# Altium project INV.5KW.OG.PrjPcb (part 1 of 3)
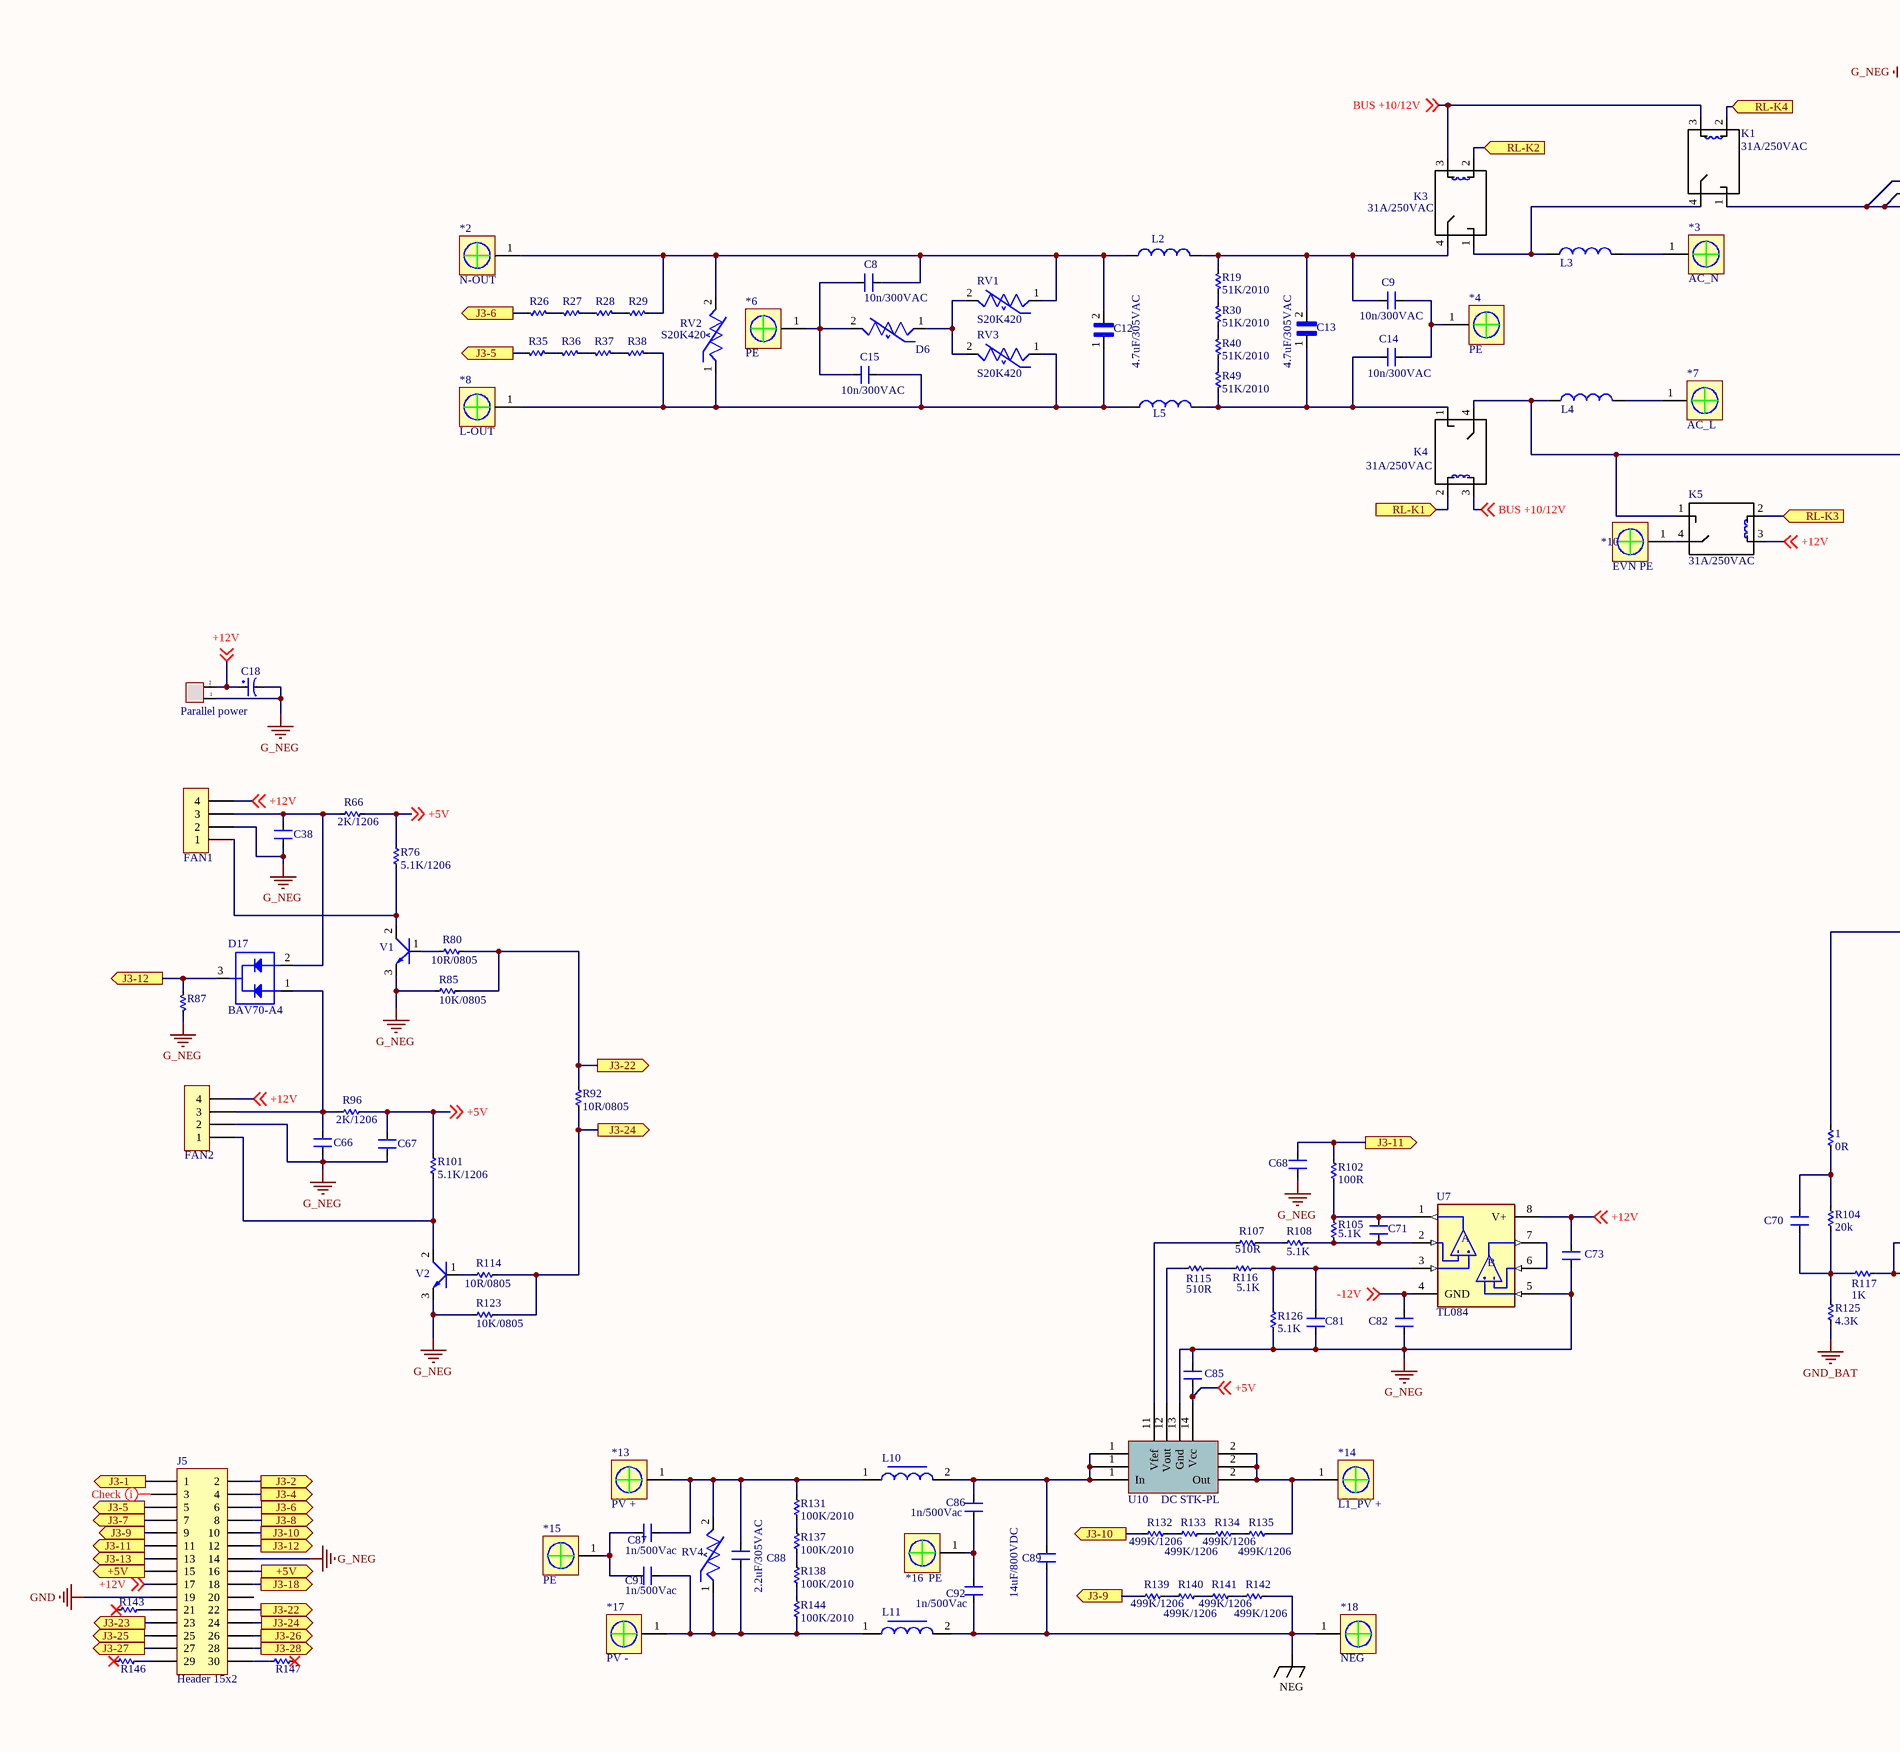
[diagram p0: INV.Power.SchDoc, left]
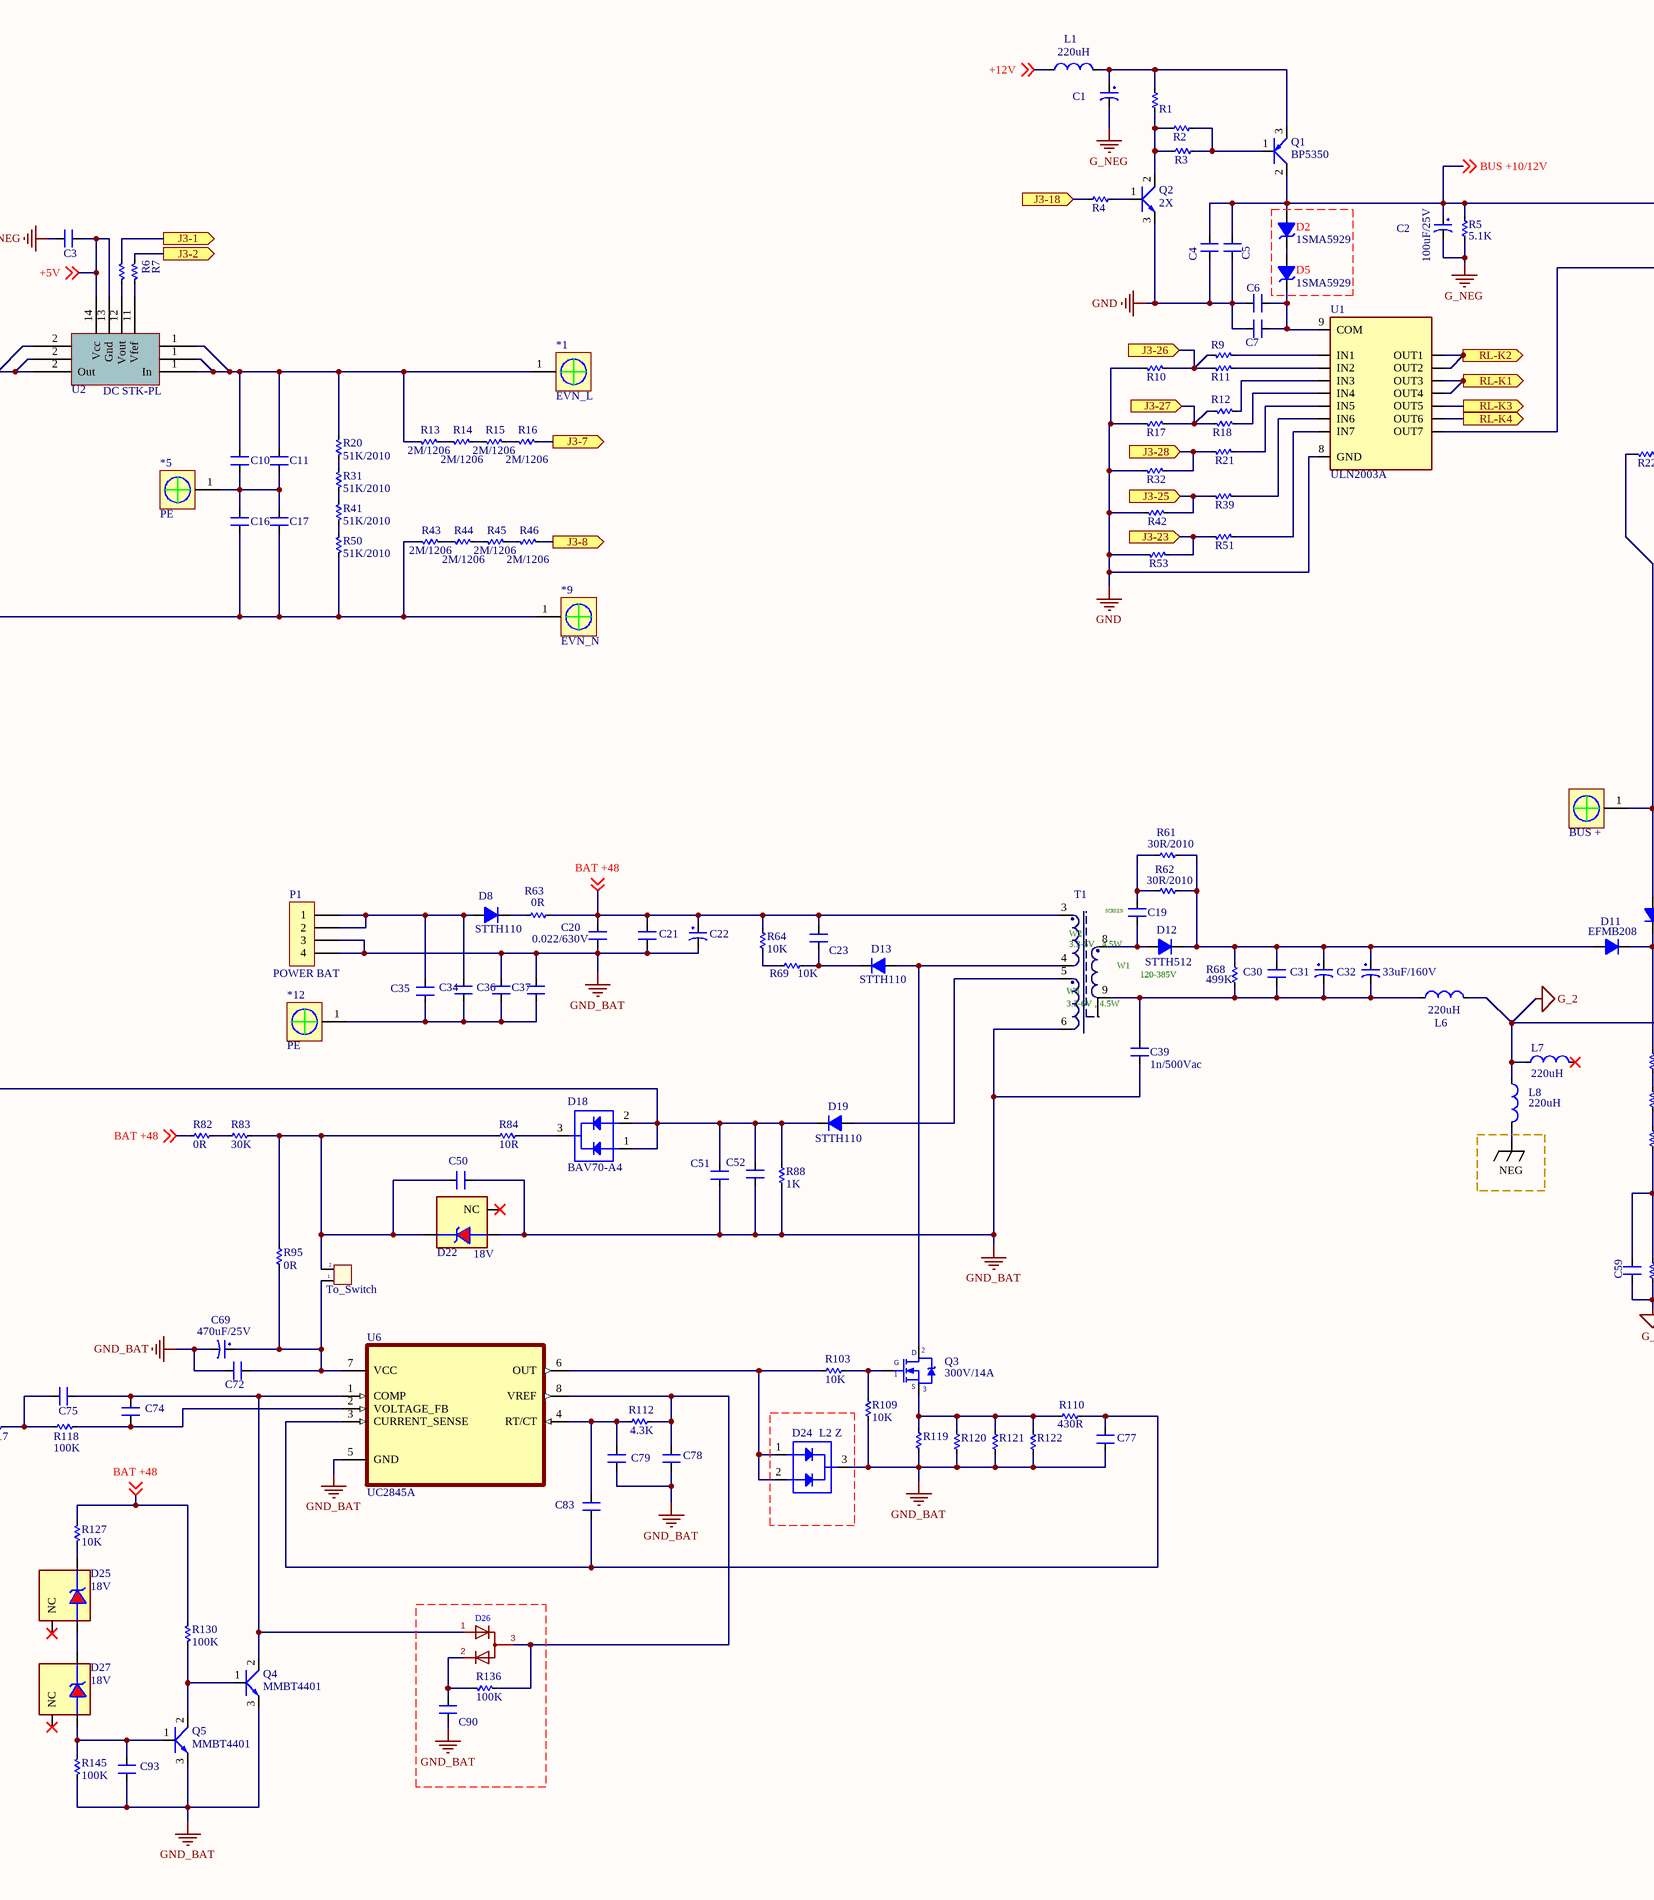
[diagram p1: INV.Power.SchDoc, middle]
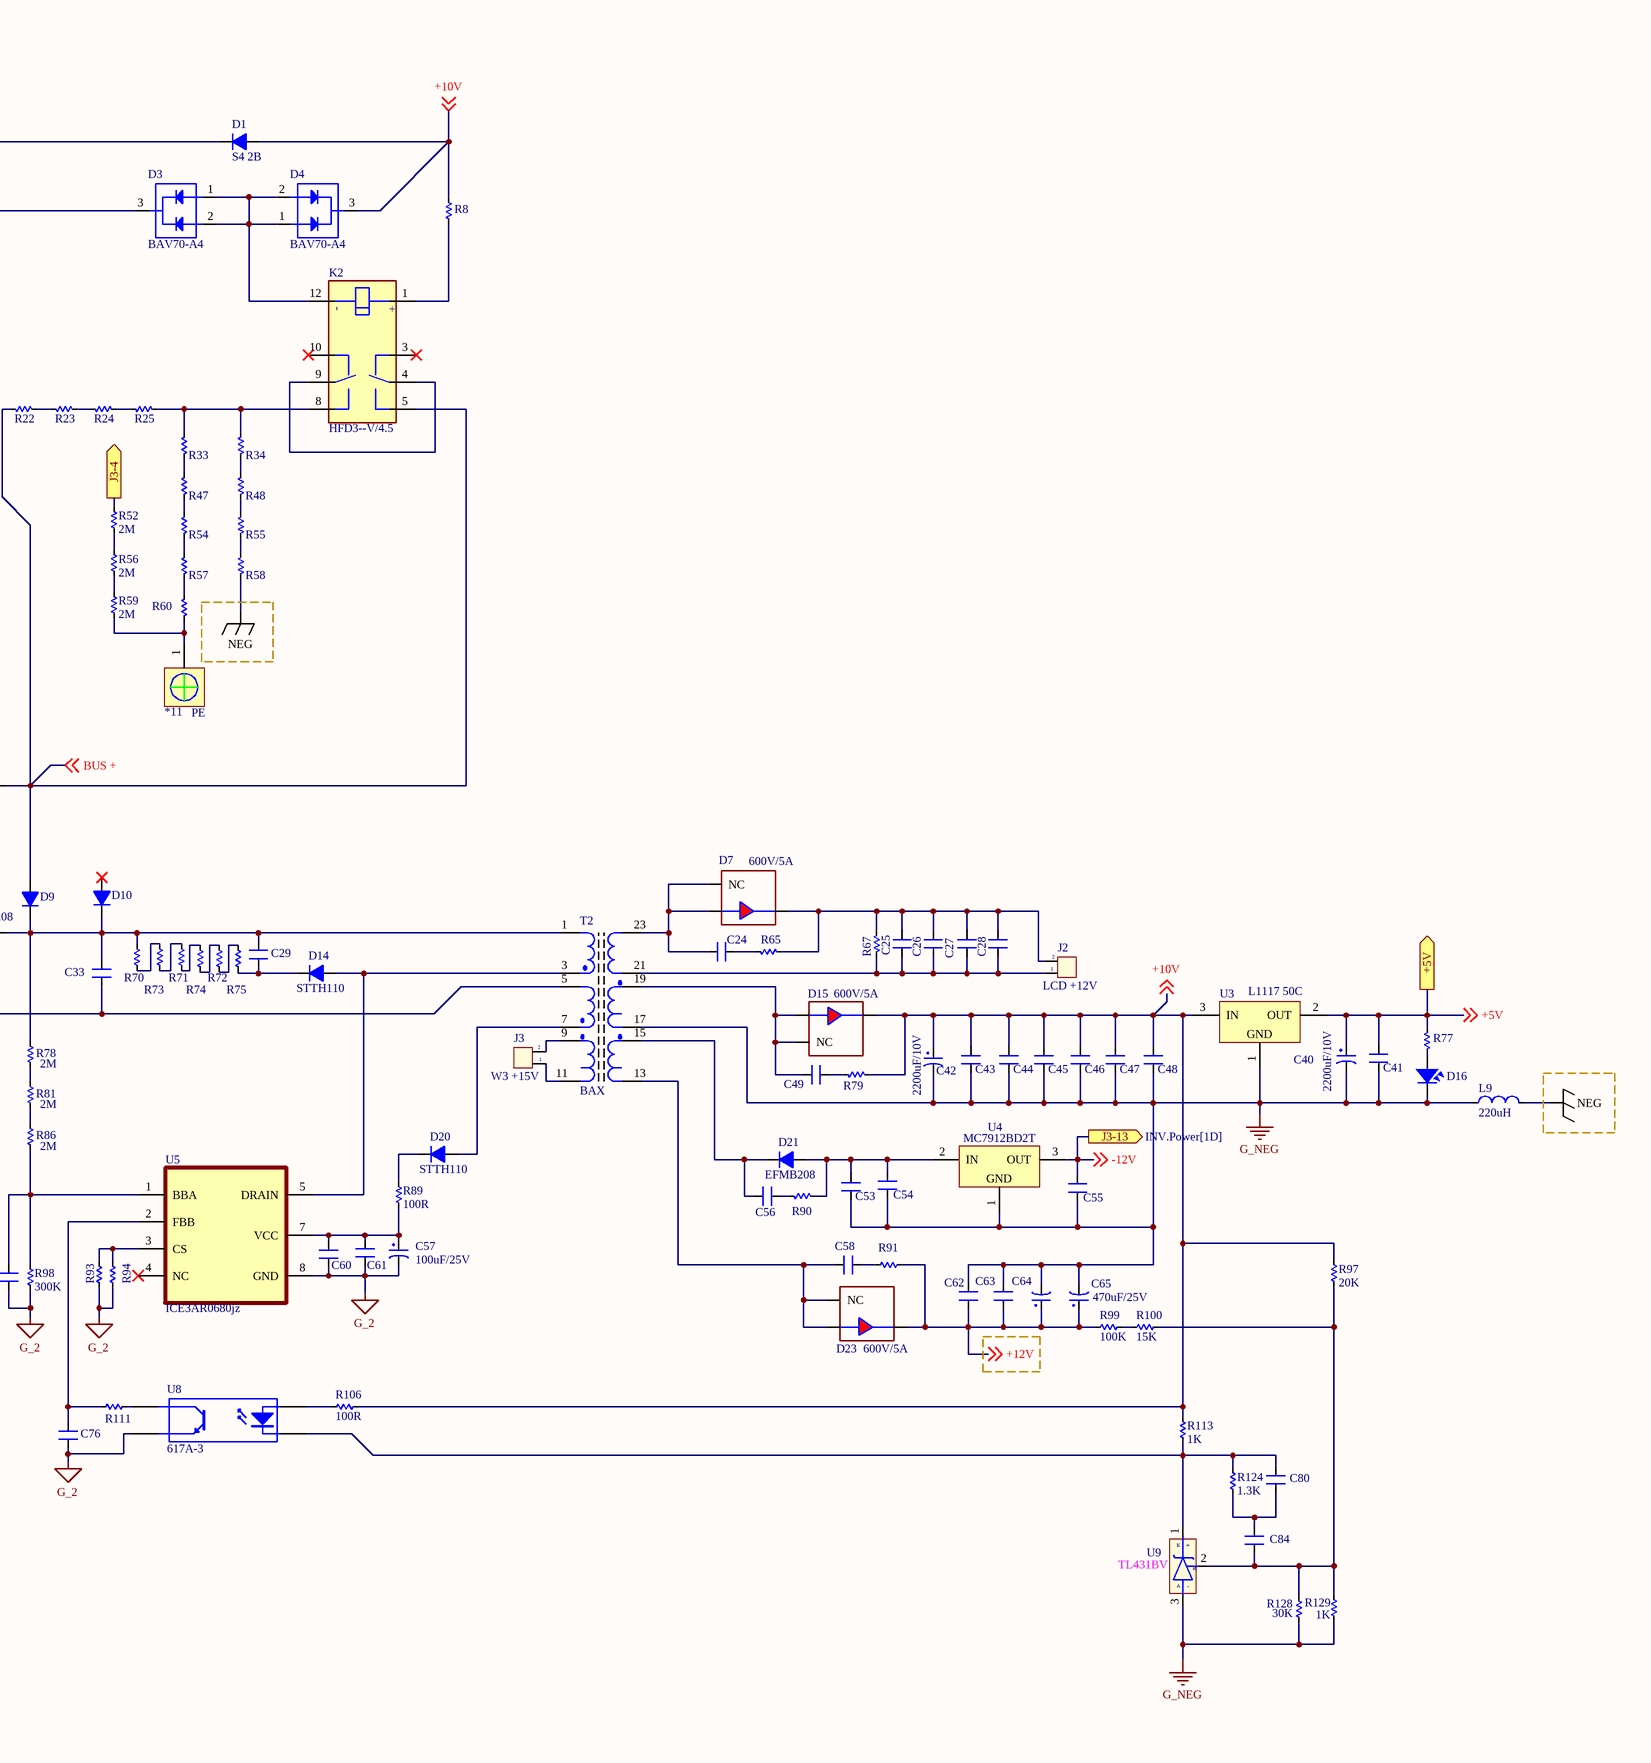
[diagram p2: INV.Power.SchDoc, right]
3 sheets, 965 parts. Net scope: flat (ports and power ports of the same name join across sheets).
Sheets:
  INV.Power.SchDoc
  INV.Main.SchDoc
  INV.ControlMCU.SchDoc

## Sheet INV.Power.SchDoc
size 1050 x 400 mm; SheetNumber: 1; SheetTotal: 3

### Parts
1  0R  [RES-SMD-0603 EX]
*1  EVN_L  [Copper Pipe]
*2  N-OUT  [Copper Pipe]
*3  AC_N  [Copper Pipe]
*4  PE  [Copper Pipe]
*5  PE  [Copper Pipe]
*6  PE  [Copper Pipe]
*7  AC_L  [Copper Pipe]
*8  L-OUT  [Copper Pipe]
*9  EVN_N  [Copper Pipe]
*10  EVN PE  [Copper Pipe]
*11  PE  [Copper Pipe]
*12  PE  [Copper Pipe]
*13  PV +  [Copper Pipe]
*14  L1_PV +  [Copper Pipe]
*15  PE  [Copper Pipe]
*16  PE  [Copper Pipe]
*17  PV -  [Copper Pipe]
*18  NEG  [Copper Pipe]
C1  100uF/25V  [CAP-10X17-N]  (value not drawn)
C2  100uF/25V  [CAP-10X17-N]
C3  10n/300VAC  [CAP-SMD-0805 EX]  (value not drawn)
C4  (no value)  [CAP-SMD-0805 EX]
C5  (no value)  [CAP-SMD-0805 EX]
C6  (no value)  [CAP-SMD-0805 EX]
C7  (no value)  [CAP-SMD-0805 EX]
C8  10n/300VAC  [CAP-SMD-0805 EX]
C9  10n/300VAC  [CAP-SMD-0805 EX]
C10  10n/300VAC  [CAP-SMD-0805 EX]  (value not drawn)
C11  10n/300VAC  [CAP-SMD-0805 EX]  (value not drawn)
C12  4.7uF/305VAC  [CAPRR2250W80L2600T850H1500]
C13  4.7uF/305VAC  [CAPRR2250W80L2600T850H1500]
C14  10n/300VAC  [CAP-SMD-0805 EX]
C15  10n/300VAC  [CAP-SMD-0805 EX]
C16  10n/300VAC  [CAP-SMD-0805 EX]  (value not drawn)
C17  10n/300VAC  [CAP-SMD-0805 EX]  (value not drawn)
C18  470uF/25V  [CAP-10X17-N]  (value not drawn)
C19  (no value)  [CAP-SMD-0805 EX]
C20  0.022/630V  [CAP-SMD-0805 EX]
C21  (no value)  [CAP-SMD-0805 EX]
C22  27uF/100V  [CAP-10X17-N]  (value not drawn)
C23  (no value)  [CAP-SMD-0805 EX]
C24  (no value)  [CAP-SMD-0805 EX]
C25  223J630V  [CAP-SMD-0805 EX]  (value not drawn)
C26  223J630V  [CAP-SMD-0805 EX]  (value not drawn)
C27  223J630V  [CAP-SMD-0805 EX]  (value not drawn)
C28  223J630V  [CAP-SMD-0805 EX]  (value not drawn)
C29  223J630V  [CAP-SMD-0805 EX]  (value not drawn)
C30  (no value)  [CAP-SMD-0805 EX]
C31  33uF/160V  [CAP-10X17-N]  (value not drawn)
C32  33uF/160V  [CAP-10X17-N]
C33  2uF/600VDC  [CAP-SMD-0805 EX]  (value not drawn)
C34  (no value)  [CAP-SMD-0805 EX]
C35  (no value)  [CAP-SMD-0805 EX]
C36  (no value)  [CAP-SMD-0805 EX]
C37  (no value)  [CAP-SMD-0805 EX]
C38  (no value)  [CAP-SMD-0805 EX]
C39  1n/500Vac  [CAP-SMD-0805 EX]
C40  2200uF/10V  [CAP-10X17-N]
C41  (no value)  [CAP-SMD-0805 EX]
C42  2200uF/10V  [CAP-10X17-N]
C43  (no value)  [CAP-SMD-0805 EX]
C44  (no value)  [CAP-SMD-0805 EX]
C45  (no value)  [CAP-SMD-0805 EX]
C46  (no value)  [CAP-SMD-0805 EX]
C47  (no value)  [CAP-SMD-0805 EX]
C48  (no value)  [CAP-SMD-0805 EX]
C49  (no value)  [CAP-SMD-0805 EX]
C50  (no value)  [CAP-SMD-0805 EX]
C51  (no value)  [CAP-SMD-0805 EX]
C52  (no value)  [CAP-SMD-0805 EX]
C53  (no value)  [CAP-SMD-0805 EX]
C54  (no value)  [CAP-SMD-0805 EX]
C55  (no value)  [CAP-SMD-0805 EX]
C56  (no value)  [CAP-SMD-0805 EX]
C57  100uF/25V  [CAP-10X17-N]
C58  (no value)  [CAP-SMD-0805 EX]
C59  (no value)  [CAP-SMD-0805 EX]
C60  223J630V  [CAP-SMD-0805 EX]  (value not drawn)
C61  223J630V  [CAP-SMD-0805 EX]  (value not drawn)
C62  (no value)  [CAP-SMD-0805 EX]
C63  (no value)  [CAP-SMD-0805 EX]
C64  470uF/25V  [CAP-10X17-N]  (value not drawn)
C65  470uF/25V  [CAP-10X17-N]
C66  (no value)  [CAP-SMD-0805 EX]
C67  (no value)  [CAP-SMD-0805 EX]
C68  (no value)  [CAP-SMD-0805 EX]
C69  470uF/25V  [CAP-10X17-N]
C70  (no value)  [CAP-SMD-0805 EX]
C71  (no value)  [CAP-SMD-0805 EX]
C72  (no value)  [CAP-SMD-0805 EX]
C73  (no value)  [CAP-SMD-0805 EX]
C74  (no value)  [CAP-SMD-0805 EX]
C75  (no value)  [CAP-SMD-0805 EX]
C76  (no value)  [CAP-SMD-0805 EX]
C77  (no value)  [CAP-SMD-0805 EX]
C78  (no value)  [CAP-SMD-0805 EX]
C79  (no value)  [CAP-SMD-0805 EX]
C80  (no value)  [CAP-SMD-0805 EX]
C81  (no value)  [CAP-SMD-0805 EX]
C82  (no value)  [CAP-SMD-0805 EX]
C83  (no value)  [CAP-SMD-0805 EX]
C84  (no value)  [CAP-SMD-0805 EX]
C85  (no value)  [CAP-SMD-0805 EX]
C86  1n/500Vac  [CAP-SMD-0805 EX]
C87  1n/500Vac  [CAP-SMD-0805 EX]
C88  2.2uF/305VAC  [CAP-SMD-0805 EX]
C89  14uF/800VDC  [CAP-SMD-0805 EX]
C90  (no value)  [CAP-SMD-0805 EX]
C91  1n/500Vac  [CAP-SMD-0805 EX]
C92  1n/500Vac  [CAP-SMD-0805 EX]
C93  (no value)  [CAP-SMD-0805 EX]
D1  S4 2B  [1N4148]
D2  1SMA5929  [DIODE ZENNER SOD123 *]
D3  BAV70-A4  [DIO_STTH2003CG-TR]
D4  BAV70-A4  [DIO_STTH2003CG-TR]
D5  1SMA5929  [DIODE ZENNER SOD123 *]
D6  EPCOS  [VAR_B72220S0301K101]  (value not drawn)
D7  600V/5A  [SOT95P237X112-3N]
D8  STTH110  [1N4148]
D9  EFMB208  [1N4148]  (value not drawn)
D10  EFMB208  [1N4148]  (value not drawn)
D11  EFMB208  [1N4148]
D12  STTH512  [1N4148]
D13  STTH110  [1N4148]
D14  STTH110  [1N4148]
D15  600V/5A  [SOT95P237X112-3N]
D16  LED  [LED 2835 NEW]  (value not drawn)
D17  BAV70-A4  [DIO_STTH2003CG-TR]
D18  BAV70-A4  [DIO_STTH2003CG-TR]
D19  STTH110  [1N4148]
D20  STTH110  [1N4148]
D21  EFMB208  [1N4148]
D22  18V  [SOT95P237X112-3N]
D23  600V/5A  [SOT95P237X112-3N]
D24  L2 Z  [DIO_STTH2003CG-TR]
D25  18V  [SOT95P237X112-3N]
D26  Dual-Diode_CA_1  [SOT-23]  (value not drawn)
D27  18V  [SOT95P237X112-3N]
H1  FAN1  [XH2.54M-4]
H2  FAN2  [XH2.54M-4]
J1  Parallel power  [Jump2]
J2  LCD +12V  [Jump2]
J3  W3 +15V  [Jump2]
J4  To_Switch  [Jump2]
J5  Header 15x2  [Head 1X16 - CAI THANG]
K1  31A/250VAC  [RELAY 10A/250V]
K2  HFD3--V/4.5  [HFD3]
K3  31A/250VAC  [RELAY 10A/250V]
K4  31A/250VAC  [RELAY 10A/250V]
K5  31A/250VAC  [RELAY 10A/250V]
L1  220uH  [CUON LOC 1010]
L2  Cuộn L  [IND_1210]  (value not drawn)
L3  Cuộn L  [IND_1210]  (value not drawn)
L4  Cuộn L  [IND_1210]  (value not drawn)
L5  Cuộn L  [IND_1210]  (value not drawn)
L6  220uH  [CUON LOC 1010]
L7  220uH  [CUON LOC 1010]
L8  220uH  [CUON LOC 1010]
L9  220uH  [CUON LOC 1010]
L10  L  [Cuan Cam PWM Hybrid]  (value not drawn)
L11  L  [Cuan Cam PWM Hybrid]  (value not drawn)
P1  POWER BAT  [XH2.54M-4]
PV_+1  BUS +  [Copper Pipe]
Q1  BP5350  [QTO-92]
Q2  2X
Q3  300V/14A  [TO220H1]
Q4  MMBT4401
Q5  MMBT4401
R1  10K  [RES-SMD-0603 EX]  (value not drawn)
R2  2K  [RES-SMD-0603 EX]  (value not drawn)
R3  2K  [RES-SMD-0603 EX]  (value not drawn)
R4  20K  [RES-SMD-0603 EX]  (value not drawn)
R5  5.1K  [RES-SMD-0603 EX]
R6  1K/0603  [RES-SMD-0603 EX]  (value not drawn)
R7  1K/0603  [RES-SMD-0603 EX]  (value not drawn)
R8  51R  [RES-SMD-0603 EX]  (value not drawn)
R9  10R  [RES-SMD-0603 EX]  (value not drawn)
R10  5.1K  [RES-SMD-0603 EX]  (value not drawn)
R11  10R  [RES-SMD-0603 EX]  (value not drawn)
R12  10R  [RES-SMD-0603 EX]  (value not drawn)
R13  2M/1206  [RES-SMD-0603 EX]
R14  2M/1206  [RES-SMD-0603 EX]
R15  2M/1206  [RES-SMD-0603 EX]
R16  2M/1206  [RES-SMD-0603 EX]
R17  5.1K  [RES-SMD-0603 EX]  (value not drawn)
R18  10R  [RES-SMD-0603 EX]  (value not drawn)
R19  51K/2010  [RES-SMD-0603 EX]
R20  51K/2010  [RES-SMD-0603 EX]
R21  10R  [RES-SMD-0603 EX]  (value not drawn)
R22  499K  [RES-SMD-0603 EX]  (value not drawn)
R23  499K  [RES-SMD-0603 EX]  (value not drawn)
R24  499K  [RES-SMD-0603 EX]  (value not drawn)
R25  499K  [RES-SMD-0603 EX]  (value not drawn)
R26  2M/1206  [RES-SMD-0603 EX]  (value not drawn)
R27  2M/1206  [RES-SMD-0603 EX]  (value not drawn)
R28  2M/1206  [RES-SMD-0603 EX]  (value not drawn)
R29  2M/1206  [RES-SMD-0603 EX]  (value not drawn)
R30  51K/2010  [RES-SMD-0603 EX]
R31  51K/2010  [RES-SMD-0603 EX]
R32  5.1K  [RES-SMD-0603 EX]  (value not drawn)
R33  200K  [RES-SMD-0603 EX]  (value not drawn)
R34  499K  [RES-SMD-0603 EX]  (value not drawn)
R35  2M/1206  [RES-SMD-0603 EX]  (value not drawn)
R36  2M/1206  [RES-SMD-0603 EX]  (value not drawn)
R37  2M/1206  [RES-SMD-0603 EX]  (value not drawn)
R38  2M/1206  [RES-SMD-0603 EX]  (value not drawn)
R39  10R  [RES-SMD-0603 EX]  (value not drawn)
R40  51K/2010  [RES-SMD-0603 EX]
R41  51K/2010  [RES-SMD-0603 EX]
R42  5.1K  [RES-SMD-0603 EX]  (value not drawn)
R43  2M/1206  [RES-SMD-0603 EX]
R44  2M/1206  [RES-SMD-0603 EX]
R45  2M/1206  [RES-SMD-0603 EX]
R46  2M/1206  [RES-SMD-0603 EX]
R47  200K  [RES-SMD-0603 EX]  (value not drawn)
R48  499K  [RES-SMD-0603 EX]  (value not drawn)
R49  51K/2010  [RES-SMD-0603 EX]
R50  51K/2010  [RES-SMD-0603 EX]
R51  10R  [RES-SMD-0603 EX]  (value not drawn)
R52  2M  [RES-SMD-0603 EX]
R53  5.1K  [RES-SMD-0603 EX]  (value not drawn)
R54  200K  [RES-SMD-0603 EX]  (value not drawn)
R55  499K  [RES-SMD-0603 EX]  (value not drawn)
R56  2M  [RES-SMD-0603 EX]
R57  200K  [RES-SMD-0603 EX]  (value not drawn)
R58  499K  [RES-SMD-0603 EX]  (value not drawn)
R59  2M  [RES-SMD-0603 EX]
R60  200K  [RES-SMD-0603 EX]  (value not drawn)
R61  30R/2010  [RES-SMD-0603 EX]
R62  30R/2010  [RES-SMD-0603 EX]
R63  0R  [RES-SMD-0603 EX]
R64  10K  [RES-SMD-0603 EX]
R65  10K/2010  [RES-SMD-0603 EX]  (value not drawn)
R66  2K/1206  [RES-SMD-0603 EX]
R67  10K/2010  [RES-SMD-0603 EX]  (value not drawn)
R68  499K  [RES-SMD-0603 EX]
R69  10K  [RES-SMD-0603 EX]
R70  10K/2010  [RES-SMD-0603 EX]  (value not drawn)
R71  10K/2010  [RES-SMD-0603 EX]  (value not drawn)
R72  10K/2010  [RES-SMD-0603 EX]  (value not drawn)
R73  10K/2010  [RES-SMD-0603 EX]  (value not drawn)
R74  10K/2010  [RES-SMD-0603 EX]  (value not drawn)
R75  10K/2010  [RES-SMD-0603 EX]  (value not drawn)
R76  5.1K/1206  [RES-SMD-0603 EX]
R77  5.1K  [RES-SMD-0603 EX]  (value not drawn)
R78  2M  [RES-SMD-0603 EX]
R79  10K/2010  [RES-SMD-0603 EX]  (value not drawn)
R80  10R/0805  [RES-SMD-0603 EX]
R81  2M  [RES-SMD-0603 EX]
R82  0R  [RES-SMD-0603 EX]
R83  30K  [RES-SMD-0603 EX]
R84  10R  [RES-SMD-0603 EX]
R85  10K/0805  [RES-SMD-0603 EX]
R86  2M  [RES-SMD-0603 EX]
R87  5.1K/1206  [RES-SMD-0603 EX]  (value not drawn)
R88  1K  [RES-SMD-0603 EX]
R89  100R  [RES-SMD-0603 EX]
R90  150R/1206  [RES-SMD-0603 EX]  (value not drawn)
R91  150R/1206  [RES-SMD-0603 EX]  (value not drawn)
R92  10R/0805  [RES-SMD-0603 EX]
R93  0.33R/2010  [RES-SMD-0603 EX]  (value not drawn)
R94  0.33R/2010  [RES-SMD-0603 EX]  (value not drawn)
R95  0R  [RES-SMD-0603 EX]
R96  2K/1206  [RES-SMD-0603 EX]
R97  20K  [RES-SMD-0603 EX]
R98  300K  [RES-SMD-0603 EX]
R99  100K  [RES-SMD-0603 EX]
R100  15K  [RES-SMD-0603 EX]
R101  5.1K/1206  [RES-SMD-0603 EX]
R102  100R  [RES-SMD-0603 EX]
R103  10K  [RES-SMD-0603 EX]
R104  20k  [RES-SMD-0603 EX]
R105  5.1K  [RES-SMD-0603 EX]
R106  100R  [RES-SMD-0603 EX]
R107  510R  [RES-SMD-0603 EX]
R108  5.1K  [RES-SMD-0603 EX]
R109  10K  [RES-SMD-0603 EX]
R110  430R  [RES-SMD-0603 EX]
R111  22R  [RES-SMD-0603 EX]  (value not drawn)
R112  4.3K  [RES-SMD-0603 EX]
R113  1K  [RES-SMD-0603 EX]
R114  10R/0805  [RES-SMD-0603 EX]
R115  510R  [RES-SMD-0603 EX]
R116  5.1K  [RES-SMD-0603 EX]
R117  1K  [RES-SMD-0603 EX]
R118  100K  [RES-SMD-0603 EX]
R119  0.33R/2010  [RES-SMD-0603 EX]  (value not drawn)
R120  0.33R/2010  [RES-SMD-0603 EX]  (value not drawn)
R121  0.33R/2010  [RES-SMD-0603 EX]  (value not drawn)
R122  0.33R/2010  [RES-SMD-0603 EX]  (value not drawn)
R123  10K/0805  [RES-SMD-0603 EX]
R124  1.3K  [RES-SMD-0603 EX]
R125  4.3K  [RES-SMD-0603 EX]
R126  5.1K  [RES-SMD-0603 EX]
R127  10K  [RES-SMD-0603 EX]
R128  30K  [RES-SMD-0603 EX]
R129  1K  [RES-SMD-0603 EX]
R130  100K  [RES-SMD-0603 EX]
R131  100K/2010  [RES-SMD-0603 EX]
R132  499K/1206  [RES-SMD-0603 EX]
R133  499K/1206  [RES-SMD-0603 EX]
R134  499K/1206  [RES-SMD-0603 EX]
R135  499K/1206  [RES-SMD-0603 EX]
R136  100K  [RES-SMD-0603 EX]
R137  100K/2010  [RES-SMD-0603 EX]
R138  100K/2010  [RES-SMD-0603 EX]
R139  499K/1206  [RES-SMD-0603 EX]
R140  499K/1206  [RES-SMD-0603 EX]
R141  499K/1206  [RES-SMD-0603 EX]
R142  499K/1206  [RES-SMD-0603 EX]
R143  (no value)  [RES-SMD-0603 EX]
R144  100K/2010  [RES-SMD-0603 EX]
R145  100K  [RES-SMD-0603 EX]
R146  (no value)  [RES-SMD-0603 EX]
R147  (no value)  [RES-SMD-0603 EX]
RV1  S20K420  [VAR_B72220S0301K101]
RV2  S20K420  [VAR_B72220S0301K101]
RV3  S20K420  [VAR_B72220S0301K101]
RV4  S20K420  [VAR_B72220S0301K101]  (value not drawn)
T1  (no value)  [EE16/7/4 (E16)]
T2  BAX  [BAX_DVD3]
U1  ULN2003A  [TSSOP-16-TI]
U2  DC STK-PL  [Bien ap do Current]
U3  L1117 50C  [SOT89N (3D)]
U4  MC7912BD2T  [HDR1x3 BIG]
U5  ICE3AR0680jz  [SOIC127P600X175-8N]
U6  UC2845A  [SOIC127P600X175-8N]
U7  TL084  [DIP794W45P254L959H508Q8]
U8  617A-3  [OPTO TRANSISTOR_SOP-4]
U9  TL431BV  [TL431]
U10  DC STK-PL  [Bien ap do Current]
V1  (no value)
V2  (no value)

### Ports
+5V (out, see INV.ControlMCU[1D], INV.Main[1D], INV.Main[3A], INV.Main[3D], INV.Main[4A], INV.Power[1D]), +5V (out, see INV.ControlMCU[1D], INV.Main[1D], INV.Main[3A], INV.Main[3D], INV.Main[4A], INV.Power[1D], INV.Power[6C]), J3-1 (out, see INV.Power[1D]), J3-1 (out, see INV.Power[3A]), J3-2 (out, see INV.Power[1D]), J3-2 (out, see INV.Power[3A]), J3-4 (out, see INV.Power[1D]), J3-4 (out, see INV.Power[5B]), J3-5 (out, see INV.Power[1B]), J3-5 (out, see INV.Power[1D]), J3-6 (out, see INV.Power[1A]), J3-6 (out, see INV.Power[1D]), J3-7 (out, see INV.Power[1D]), J3-7 (out, see INV.Power[3A]), J3-8 (out, see INV.Power[1D]), J3-8 (out, see INV.Power[3B]), J3-9 (out, see INV.Power[1D]), J3-9 (out, see INV.Power[2D]), J3-10 (out, see INV.Power[1D]), J3-10 (out, see INV.Power[2D]), J3-11 (out, see INV.Power[1D]), J3-11 (out, see INV.Power[2C]), J3-12 (out, see INV.Power[1C]), J3-12 (out, see INV.Power[1D]), J3-13 (out, see INV.Power[1D]), J3-13 (out, see INV.Power[6C]), J3-18 (in, see INV.Power[1D]), J3-18 (out, see INV.Power[4A]), J3-22 (out, see INV.Power[1C]), J3-22 (out, see INV.Power[1D]), J3-23 (in, see INV.Power[1D]), J3-23 (out, see INV.Power[4B]), J3-24 (out, see INV.Power[1C]), J3-24 (out, see INV.Power[1D]), J3-25 (in, see INV.Power[1D]), J3-25 (out, see INV.Power[4B]), J3-26 (in, see INV.Power[1D]), J3-26 (out, see INV.Power[4A]), J3-27 (in, see INV.Power[1D]), J3-27 (out, see INV.Power[4A]), J3-28 (in, see INV.Power[1D]), J3-28 (out, see INV.Power[4A]), RL-K1 (in, see INV.Power[4A]), RL-K1 (out, see INV.Power[2B]), RL-K2 (in, see INV.Power[4A]), RL-K2 (out, see INV.Power[2A]), RL-K3 (in, see INV.Power[4A]), RL-K3 (out, see INV.Power[3B]), RL-K4 (in, see INV.Power[4A]), RL-K4 (out, see INV.Power[3A])

### Nets
G_2: C33.1 C57.2 C59.1 C60.2 C61.2 C76.1 L6.2 L7.2 L8.2 R93.2 R94.2 R98.1 T2.5 U5.8(GND) U8.3
G_NEG: C1.2 C2.2 C3.1 C18.2 C38.1 C40.2 C41.2 C42.2 C43.2 C44.2 C45.2 C46.2 C47.2 C48.2 C53.1 C54.1 C55.1 C62.1 C63.1 C64.2 C65.2 C66.1 C67.1 C68.2 C73.2 C81.2 C82.2 C85.2 D16.2 H1.2 H2.2 J1.1 J5.14 L9.1 R5.1 R85.2 R87.1 R123.2 R126.2 R128.1 R129.1 T2.17 U3.1(GND) U4.1(GND) U7.5(+INB) U9.3(-) U10.13(Gnd) V1.3(E) V2.3(E)
GND: C4.1 C5.1 C6.1 C7.1 J5.19 Q2.3(E) R10.2 R17.2 R32.2 R42.2 R53.2 U1.8(GND)
GND_BAT: C20.1 C21.1 C22.2 C36.2 C37.2 C39.2 C50.1 C51.1 C52.1 C69.2 C72.1 C77.1 C78.1 C79.1 C90.1 C93.2 D22.1(A) D24.3(K) P1.3 P1.4 Q4.3(E) Q5.3(E) R88.2 R109.2 R119.2 R120.2 R121.2 R122.2 R125.2 R145.2 T1.6 U6.5(GND)
NEG: *18.1 C89.1 C92.2 L8.1 L9.2 L11.2 R58.2 R142.1
+5V: C3.2 C40.1 C41.1 C67.2 C85.1 J5.15 J5.16 R66.2 R76.2 R77.2 R96.2 R101.2 U2.13(Gnd) U2.14(Vcc) U3.2(OUT) U10.14(Vcc) ; off-sheet +5V, port +5V
+10V: C42.1 C43.1 C44.1 C45.1 C46.1 C47.1 C48.1 D1.1(A) D4.3(K) D15.3(K) R8.1 R79.1 R97.1 R106.1 R113.1 U3.3(IN) ; off-sheet +10V
+12V: C18.1 C62.2 C63.2 C64.1 C65.1 C73.1 D23.3(K) H1.4 H2.4 J1.2 J5.17 K5.3 L1.1 R91.1 R99.2 U7.8(V+) ; off-sheet +12V
-12V: C55.2 C82.1 J5.13 U4.3(OUT) U7.4(GND) ; off-sheet -12V, port J3-13
BAT +48: C20.2 C21.2 C22.1 C23.1 R63.2 R64.1 R82.1 R127.2 R130.1 T1.3 ; off-sheet BAT +48
BUS +: D9.1(A) K2.5 PV_+1.1 R22.1 ; off-sheet BUS +
BUS +10/12V: C2.1 C4.2 C5.2 D1.2(K) D2.2(A) K1.3 K3.3 K4.3 Q1.2(C) R5.2 ; off-sheet BUS +10/12V
Net1_1: 1.1 C51.2 C52.2 D18.1(A1) D18.2(A2) D19.2(K) R88.1
Net1_2: 1.2 C70.2 R104.1
Net*1_1: *1.1 C10.1 C11.1 R13.1 R20.1 U2.1(In)
Net*2_1: *2.1 C8.1 C12.2 L2.2 R29.1 RV1.1 RV2.2
Net*3_1: *3.1 L3.1
Net*4_1: *4.1 C9.2 C14.1
Net*5_1: *5.1 C10.2 C11.2 C16.1 C17.1
Net*6_1: *6.1 C8.2 C15.2 D6.2
Net*7_1: *7.1 L4.1
Net*8_1: *8.1 C12.1 C15.1 L5.2 R38.1 RV2.1 RV3.1
Net*9_1: *9.1 C16.2 C17.2 K4.4 K5.1 L4.2 R43.1 R50.2
Net*10_1: *10.1 K5.4
Net*11_1: *11.1 R59.1 R60.2
Net*12_1: *12.1 C34.1 C35.1 C36.1 C37.1
Net*13_1: *13.1 C87.2 C88.2 L10.1 R131.1 RV4.2
Net*14_1: *14.1 R135.1 U10.2(Out)
Net*15_1: *15.1 C87.1 C91.1
Net*16_1: *16.1 C86.1 C92.1
Net*17_1: *17.1 C88.1 C91.2 L11.1 R144.1 RV4.1
NetC1_1: C1.1 L1.2 Q1.3(E) R1.2
NetC6_2: C6.2 C7.2 D5.1(K) U1.9(COM)
NetC9_1: C9.1 C13.2 K3.4 L2.1 R19.1
NetC13_1: C13.1 C14.2 K4.1 L5.1 R49.2
NetC19_1: C19.1 D12.1(A) T1.8
NetC19_2: C19.2 R61.1 R62.1
NetC23_2: C23.2 D13.2(K) R69.1
NetC24_1: C24.1 D7.1(A) D7.2(NC) T2.23
NetC24_2: C24.2 R65.1
NetC25_1: C25.1 C26.1 C27.1 C28.1 D7.3(K) J2.2 R65.2 R67.1
NetC25_2: C25.2 C26.2 C27.2 C28.2 J2.1 R67.2 T2.21
NetC29_1: C29.1 D14.2(K) R75.1
NetC29_2: C29.2 C33.2 D9.2(K) D10.2(K) D11.2(K) R70.2 R78.2 T2.1
NetC30_1: C30.1 C31.1 C32.1 D11.1(A) D12.2(K) R61.2 R62.2 R68.1
NetC30_2: C30.2 C31.2 C32.2 C39.1 L6.1 R68.2 T1.9
NetC34_2: C34.2 C35.2 D8.1(A) P1.1 P1.2
NetC38_2: C38.2 D17.2(A2) H1.3 R66.1
NetC49_1: C49.1 R79.2
NetC49_2: C49.2 D15.1(A) D15.2(NC) T2.19
NetC50_2: C50.2 D22.3(K) J4.2 R83.2 R84.1 R95.1
NetC53_2: C53.2 C54.2 D21.1(A) R90.1 U4.2(IN)
NetC56_1: C56.1 R90.2
NetC56_2: C56.2 D21.2(K) T2.15
NetC57_1: C57.1 C60.1 C61.1 R89.2 U5.7(VCC)
NetC58_1: C58.1 R91.2
NetC58_2: C58.2 D23.1(A) D23.2(NC) T2.13
NetC59_2: C59.2 R86.1 R98.2 U5.1(BBA)
NetC66_2: C66.2 D17.1(A1) H2.3 R96.1
NetC68_1: C68.1 J5.11 R102.2 ; port J3-11
NetC69_1: C69.1 C72.2 J4.1 R95.2 U6.7(VCC)
NetC70_1: C70.1 R104.2 R117.2 R125.1
NetC71_1: C71.1 R105.1 R108.1 U7.2(-INA)
NetC71_2: C71.2 R102.1 R105.2 U7.1(OUTA)
NetC74_1: C74.1 C75.2 D26.1(C) Q4.2(C) U6.1(COMP)
NetC74_2: C74.2 R118.1 U6.2(VOLTAGE_FB)
NetC75_1: C75.1 R117.1 R118.2
NetC76_2: C76.2 R111.1 U5.2(FBB)
NetC77_2: C77.2 C83.1 R110.2 U6.3(CURRENT_SENSE)
NetC78_2: C78.2 D26.3(A) R112.2 R136.1 U6.8(VREF)
NetC79_2: C79.2 C83.2 R112.1 U6.4(RT/CT)
NetC80_1: C80.1 R113.2 R124.1 U8.2 U9.1(+)
NetC80_2: C80.2 C84.1 R124.2
NetC81_1: C81.1 R116.2 R126.1 U7.3(+INA)
NetC84_2: C84.2 R97.2 R100.1 R128.2 R129.2 U9.2(adj)
NetC86_2: C86.2 C89.2 L10.2 U10.1(In)
NetC90_2: C90.2 D26.2(C) R136.2
NetC93_1: C93.1 D27.1(A) Q5.1(B) R145.1
NetD2_1: D2.1(K) D5.2(A)
NetD3_1: D3.1(A1) D3.2(A2) D4.1(A1) D4.2(A2) K2.12
NetD3_3: D3.3(K) U1.10(OUT7)
NetD6_1: D6.1 RV1.2 RV3.2
NetD8_2: D8.2(K) R63.1
NetD13_1: D13.1(A) Q3.2(D) T1.4
NetD14_1: D14.1(A) T2.3 U5.5(DRAIN)
NetD16_1: D16.1 R77.1
NetD17_3: D17.3(K) J5.12 R87.2 ; port J3-12
NetD18_3: D18.3(K) R84.2
NetD19_1: D19.1(A) T1.5
NetD20_1: D20.1(A) T2.7
NetD20_2: D20.2(K) R89.1
NetD24_1: D24.1(A1) D24.2(A2) R103.2 U6.6(OUT)
NetD25_1: D25.1(A) D27.3(K)
NetD25_3: D25.3(K) R127.1
NetH1_1: H1.1 R76.1 V1.2(C)
NetH2_1: H2.1 R101.1 V2.2(C)
NetJ3_1: J3.1 T2.11
NetJ3_2: J3.2 T2.9
NetJ5_1: J5.1 R6.1 ; port J3-1
NetJ5_2: J5.2 R7.1 ; port J3-2
NetJ5_4: J5.4 R52.2 ; port J3-4
NetJ5_5: J5.5 R35.2 ; port J3-5
NetJ5_6: J5.6 R26.2 ; port J3-6
NetJ5_7: J5.7 R16.2 ; port J3-7
NetJ5_8: J5.8 R46.2 ; port J3-8
NetJ5_9: J5.9 R139.1 ; port J3-9
NetJ5_10: J5.10 R132.1 ; port J3-10
NetJ5_18: J5.18 R4.1 ; port J3-18
NetJ5_21: J5.21 R143.2
NetJ5_22: J5.22 R80.1 R85.1 R92.1 ; port J3-22
NetJ5_23: J5.23 R51.2 R53.1 ; port J3-23
NetJ5_24: J5.24 R92.2 R114.1 R123.1 ; port J3-24
NetJ5_25: J5.25 R39.2 R42.1 ; port J3-25
NetJ5_26: J5.26 R9.2 R10.1 R11.2 ; port J3-26
NetJ5_27: J5.27 R12.2 R17.1 R18.2 ; port J3-27
NetJ5_28: J5.28 R21.2 R32.1 ; port J3-28
NetJ5_29: J5.29 R146.2
NetJ5_30: J5.30 R147.1
NetK1_1: K1.1 U2.2(Out)
NetK1_2: K1.2 U1.11(OUT6) ; port RL-K4
NetK1_4: K1.4 K3.1 L3.2
NetK2_1: K2.1 R8.2
NetK2_4: K2.4 K2.9
NetK2_8: K2.8 R25.2 R33.1 R34.1
NetK3_2: K3.2 U1.15(OUT2) U1.16(OUT1) ; port RL-K2
NetK4_2: K4.2 U1.13(OUT4) U1.14(OUT3) ; port RL-K1
NetK5_2: K5.2 U1.12(OUT5) ; port RL-K3
NetQ1_1: Q1.1(B) R2.1 R3.2
NetQ2_1: Q2.1(B) R4.2
NetQ2_2: Q2.2(C) R1.1 R2.2 R3.1
NetQ3_1: Q3.1(G) R103.1 R109.1
NetQ3_3: Q3.3(S) R110.1 R119.1 R120.1 R121.1 R122.1
NetQ4_1: Q4.1(B) Q5.2(C) R130.2
NetR6_2: R6.2 U2.12(Vout)
NetR7_2: R7.2 U2.11(Vfef)
NetR9_1: R9.1 U1.1(IN1)
NetR11_1: R11.1 U1.2(IN2)
NetR12_1: R12.1 U1.3(IN3)
NetR13_2: R13.2 R14.1
NetR14_2: R14.2 R15.1
NetR15_2: R15.2 R16.1
NetR18_1: R18.1 U1.4(IN4)
NetR19_2: R19.2 R30.1
NetR20_2: R20.2 R31.1
NetR21_1: R21.1 U1.5(IN5)
NetR22_2: R22.2 R23.1
NetR23_2: R23.2 R24.1
NetR24_2: R24.2 R25.1
NetR26_1: R26.1 R27.2
NetR27_1: R27.1 R28.2
NetR28_1: R28.1 R29.2
NetR30_2: R30.2 R40.1
NetR31_2: R31.2 R41.1
NetR33_2: R33.2 R47.1
NetR34_2: R34.2 R48.1
NetR35_1: R35.1 R36.2
NetR36_1: R36.1 R37.2
NetR37_1: R37.1 R38.2
NetR39_1: R39.1 U1.6(IN6)
NetR40_2: R40.2 R49.1
NetR41_2: R41.2 R50.1
NetR43_2: R43.2 R44.1
NetR44_2: R44.2 R45.1
NetR45_2: R45.2 R46.1
NetR47_2: R47.2 R54.1
NetR48_2: R48.2 R55.1
NetR51_1: R51.1 U1.7(IN7)
NetR52_1: R52.1 R56.2
NetR54_2: R54.2 R57.1
NetR55_2: R55.2 R58.1
NetR56_1: R56.1 R59.2
NetR57_2: R57.2 R60.1
NetR64_2: R64.2 R69.2
NetR70_1: R70.1 R73.2
NetR71_1: R71.1 R74.2
NetR71_2: R71.2 R73.1
NetR72_1: R72.1 R75.2
NetR72_2: R72.2 R74.1
NetR78_1: R78.1 R81.2
NetR80_2: R80.2 V1.1(B)
NetR81_1: R81.1 R86.2
NetR82_2: R82.2 R83.1
NetR93_1: R93.1 R94.1 U5.3(CS)
NetR99_1: R99.1 R100.2
NetR106_2: R106.2 U8.1
NetR107_1: R107.1 U10.11(Vfef)
NetR107_2: R107.2 R108.2
NetR111_2: R111.2 U8.4
NetR114_2: R114.2 V2.1(B)
NetR115_1: R115.1 U10.12(Vout)
NetR115_2: R115.2 R116.1
NetR131_2: R131.2 R137.2
NetR132_2: R132.2 R133.2
NetR133_1: R133.1 R134.1
NetR134_2: R134.2 R135.2
NetR137_1: R137.1 R138.1
NetR138_2: R138.2 R144.2
NetR139_2: R139.2 R140.2
NetR140_1: R140.1 R141.1
NetR141_2: R141.2 R142.2
NetU7_6: U7.6(-INB) U7.7(OUTB)

Not connected (* = marked no-connect by the designer): D10 1(A)*; D22 2(NC)*; D25 2(NC)*; D27 2(NC)*; J5 3 20; K2 3* 10*; L7 1*; R143 1*; R146 1*; R147 2*; U5 4(NC)*

### Layout directives
mark named Check: NetJ5_3

### Notes on the sheet
- (in symbol HFD3--V/4.5) -; +
- (in symbol LM358N/NOPB) A; B
- (in symbol TL431) K; R; A
- (in symbol Tranf6) SCREEN; W2; 3.3-6V , 4.5W; W1; 120-385V; W3

### Library data of the parts
1 R1-R142 R144 R145 = Res-SMD: Resistor; Manufacturer: Generic Components; Class: Passive; Published: 08/06/2000; Publisher: Altium Hobart Technology Centre
*1-*18 PV_+1 = Copper
C1 C2 C18 C31 C32 C40 C42 C64 C65 = Cap - 10x18 - N: Chung_Loai: Cắm; Don_Vi: Con; So_Chan: 2; Ten_Linh_Kien: Tụ Hóa 220uF 10V 6x11MM; Ma_Hang: MH004510; Kieu_Chan: *
C3 C8-C11 C14-C17 = CAP-SMD: High Voltage Ceramic Capacitors CS103M; Value: 33pF
C4-C7 C19 C21 C23-C30 C33-C39 C41 C43-C56 C58-C63 C66-C68 C70-C93 = CAP-SMD: Value: 33pF
C12 C13 = ECWFG2J475KA: Polypropylene Film Capacitor, 305V ac, ±20%, 4.7μF; MF: Panasonic; Value: *; Price: None; Package: MOLDED-2 Panasonic; MP: ECWFG2J475KA; Availability: In Stock; Check_prices: https://www.snapeda.com/parts/ECWFG2J475KA/Panasonic/view-part/?ref=eda; SnapEDA_Link: https://www.snapeda.com/parts/ECWFG2J475KA/Panasonic/view-part/?ref=snap
C20 = CAP-SMD: WIMA MKS 4 Metallized Polyester (PET) Capacitors; Value: 33pF
C22 C57 C69 = Cap - 10x18 - N: Cắm 100uF 25V; Don_Vi: Con; So_Chan: 2; Ten_Linh_Kien: Tụ Hóa 220uF 10V 6x11MM; Ma_Hang: MH004510; Chung_Loai: Cắm; Kieu_Chan: *
D1 = DIODE: Value: 1N4007
D2 D5 = DIODE ZENNER: Diode Zenner 15V; Value: DFLZ16Q
D3 D4 D17 D18 = Diode Double: MP: STTH2003CG-TR; Package: None; Price: None; Value: *; Availability: Unavailable
D6 = Varistor B772: Chống sét lan truyền B88069X4880S102(ví dụ); MP: B72220S0301K101; MF: TDK; Purchase-URL: https://pricing.snapeda.com/search/part/B72220S0301K101/?ref=eda; Package: None; SnapEDA_Link: https://www.snapeda.com/parts/B72220S0301K101/TDK/view-part/?ref=snap; Price: None; Availability: In Stock; Value: *; Check_prices: https://www.snapeda.com/parts/B72220S0301K101/TDK/view-part/?ref=eda
D7 D15 D23 = Diode SHHT 506B: 600V/5A Diode SHHT 506B; MF: ON Semiconductor; MP: BZX84-C7V5; SnapEDA_Link: https://www.snapeda.com/parts/BZX84-C7V5/Onsemi/view-part/?ref=snap; Package: SOT-23 NXP Semiconductors; Value: *; Check_prices: https://www.snapeda.com/parts/BZX84-C7V5/Onsemi/view-part/?ref=eda
D8 D13 D14 D19 D20 = DIODE: Diode 1000V/1A SMB; Value: 1N4007
D9-D11 D21 = DIODE: Diode 600V/2A SMB thay the ES2J; Value: 1N4007
D12 = DIODE: Diode 1200V/5A; Value: 1N4007
D16 = LED: LED Single colour Green and Red; Value: LED 3 ly Single Colour
D22 D25 D27 = Diode Zener Sot-95: BZX84-C18(Y6W) Zenner 18V thay the BZT52C18; MF: ON Semiconductor; MP: BZX84-C7V5; SnapEDA_Link: https://www.snapeda.com/parts/BZX84-C7V5/Onsemi/view-part/?ref=snap; Package: SOT-23 NXP Semiconductors; Value: *; Check_prices: https://www.snapeda.com/parts/BZX84-C7V5/Onsemi/view-part/?ref=eda
D24 = Diode Double: BAS40-06 40V/120mA; MP: STTH2003CG-TR; Package: None; Price: None; Value: *; Availability: Unavailable
D26 = Dual-Diode_CA_1: BAT54S thay the BAV99:A7; ki_keywords: Dual Diode Common Anode; Value: Dual_Diode_CA; Reference: D; ki_description: Dual Diode Common Anode
H1 H2 P1 = Header 4P 2.54 Duc Thang: Cắm; Ten_Linh_Kien: Header 4P XH2.54-4P Đực Thẳng; Don_Vi: Con; Ma_Hang: MH001285; Chung_Loai: Cắm
J1-J4 = Jump2
J5 = Header 15x2: Header, 15x2-Pin 2.5mm; LatestRevisionDate: 17-Jul-2002; LatestRevisionNote: Re-released for DXP Platform.; Publisher: Altium Limited
K1 K3-K5 = RELAY 10A/250V-HF: HF161F-W 12-HT(477)
K2 = HFD3--V/4.5: MF: Hongfa; MP: HFD3/012-L2; Package: None; Price: None; Value: *; SnapEDA_Link: https://www.snapeda.com/parts/HFD3/012-L2/Hon/view-part/?ref=snap; Availability: In Stock; Check_prices: https://www.snapeda.com/parts/HFD3/012-L2/Hon/view-part/?ref=eda
L1 L6-L9 = L1: Inductor; Value: 150 mH
L2-L5 = IND_18uH-0.12A-10%-SMD: Fixed Inductors 18uH 10% 2.52MHz; Manufacturer: Wurth Electronics; Manufacturer Part Number: CMH322522-180KL; Alternate Part Number-1: NA; Case/Package: SMD; Supplier-1: ARROW; Supplier Part Number-1: CMH322522-180KL
L10 L11 = CUON CAM PWM Hybrid: Cuận cảm bộ sạc PWM Hybrid; Value: Loc 220; Designed by: VanDungEvn
Q1 = B772M-PNP: thay the B772; Value: C9015
Q2 = D882M: thay the MMPT2222 40V/06A
Q3 = MOSFET IRF N: 14N30; Value: IRF840
Q4 Q5 = D882M: NPN
R143 R146 R147 = Res-SMD: No connect; Manufacturer: Generic Components; Class: Passive; Published: 08/06/2000; Publisher: Altium Hobart Technology Centre
RV1-RV4 = Varistor B772: Varistor 420VAC 8000A(8/20us) B72220S0421K101; MP: B72220S0301K101; MF: TDK; Purchase-URL: https://pricing.snapeda.com/search/part/B72220S0301K101/?ref=eda; Package: None; SnapEDA_Link: https://www.snapeda.com/parts/B72220S0301K101/TDK/view-part/?ref=snap; Price: None; Availability: In Stock; Value: *; Check_prices: https://www.snapeda.com/parts/B72220S0301K101/TDK/view-part/?ref=eda
T1 = Tranf6: Off-Line Transformer WE-UNIT , L=0.9mH; PartNo: 749118205; Manufacturer: Würth Elektronik eiSos GmbH; Inductance: 0.9mH; Turns Ratio: 19:1:1; Input Voltage (AC): 85-265; Output Voltage (DC): 5; Output Current (A): 0.6; ComponentLink1Description: Manufacturer; ComponentLink1URL: http://www.we-online.de; Created by: Otto Christin; Created Date: OCT 2013; ComponentLink2Description: Datasheet; ComponentLink2URL: http://www.we-online.de/katalog/media/pdf/749118205.pdf
T2 = Tranfomer 2-4: Bien ap xung DVD; Designed by: VanDungEvn; Value: BAX
U1 = ULN2003A: Power Switch/Driver 1:1 Darlington 500mA 16-SOP; MF: UMW; SnapEDA_Link: https://www.snapeda.com/parts/ULN2003A/Umwelt+Sensor+Teknik/view-part/?ref=snap; Package: None; Value: *; MP: ULN2003A; Check_prices: https://www.snapeda.com/parts/ULN2003A/Umwelt+Sensor+Teknik/view-part/?ref=eda
U2 U10 = Current sensor: Bien dong sinomags STK-PL 50 0LSB8 / STK-PL/P1; Value: Loc 220; Designed by: VanDungEvn
U3 = AZ1117CR-3.3: IC 5V thay the 78M05; Note: Tab is connected to pin 3 (GND).; Published: 24-Aug-2001; LatestRevisionDate: 17-Jul-2002; LatestRevisionNote: Re-released for DXP Platform.; DatasheetVersion: Apr-1994; PackageReference: SOT82C; Publisher: Altium Limited; PackageDescription: SIP; 3 Leads; Body 10.9 x 7.6 x 2.6 mm (typ); Pitch 2.2 mm; ComponentLink1Description: Manufacturer Link; ComponentLink1URL: http://www.st.com/; ComponentLink2Description: Datasheet; ComponentLink2URL: http://www.st.com/stonline/products/literature/ds/2146/l78m05c.pdf
U4 = 7133_1: IC -12V; Note: Tab is connected to pin 3 (GND).; Published: 24-Aug-2001; LatestRevisionDate: 17-Jul-2002; LatestRevisionNote: Re-released for DXP Platform.; DatasheetVersion: Apr-1994; PackageReference: SOT82C; Publisher: Altium Limited; PackageDescription: SIP; 3 Leads; Body 10.9 x 7.6 x 2.6 mm (typ); Pitch 2.2 mm; ComponentLink1Description: Manufacturer Link; ComponentLink1URL: http://www.st.com/; ComponentLink2Description: Datasheet; ComponentLink2URL: http://www.st.com/stonline/products/literature/ds/2146/l78m05c.pdf
U5 = ICE3AR0680jz: HIGH PERFORMANCE CURRENT MODE PWM CONTROLLER; MP: UC2845BD1; Package: None; Price: None; Value: *; Availability: Unavailable
U6 = UC3843BVD1G: MF: ON Semiconductor; Package: SOIC-8 ON Semiconductor; Price: None; Check_prices: https://www.snapeda.com/parts/UC3843BVD1G/Onsemi/view-part/?ref=eda; Value: *; SnapEDA_Link: https://www.snapeda.com/parts/UC3843BVD1G/Onsemi/view-part/?ref=snap; MP: UC3843BVD1G; Availability: In Stock; Purchase-URL: https://pricing.snapeda.com/search?q=UC3843BVD1G&ref=eda
U7 = LM358N/NOPB: Dual, 32-V, 1-MHz op amp; MF: Texas Instruments; SnapEDA_Link: https://www.snapeda.com/parts/LM358N/NOPB/Texas+Instruments/view-part/?ref=snap; Package: PDIP-8 Texas; MP: LM358N/NOPB; Check_prices: https://www.snapeda.com/parts/LM358N/NOPB/Texas+Instruments/view-part/?ref=eda; Purchase-URL: https://pricing.snapeda.com/search/part/LM358N/NOPB/?ref=eda; Price: None; Value: *; Availability: In Stock
U8 = VOM617A-2T: OPTOISOLATOR 3.75KV TRANS 4-SOP; Solder: SMT; CompanyID: VT-xxxx; MPN: VOM617A-2T; Value: VOM617A-2T
U9 = TL431: SOIC 8 TL431BD
V1 V2 = D882M